# Altium schematic sheet Clock.SchDoc
size A3; SheetNumber: 8; SheetTotal: 13
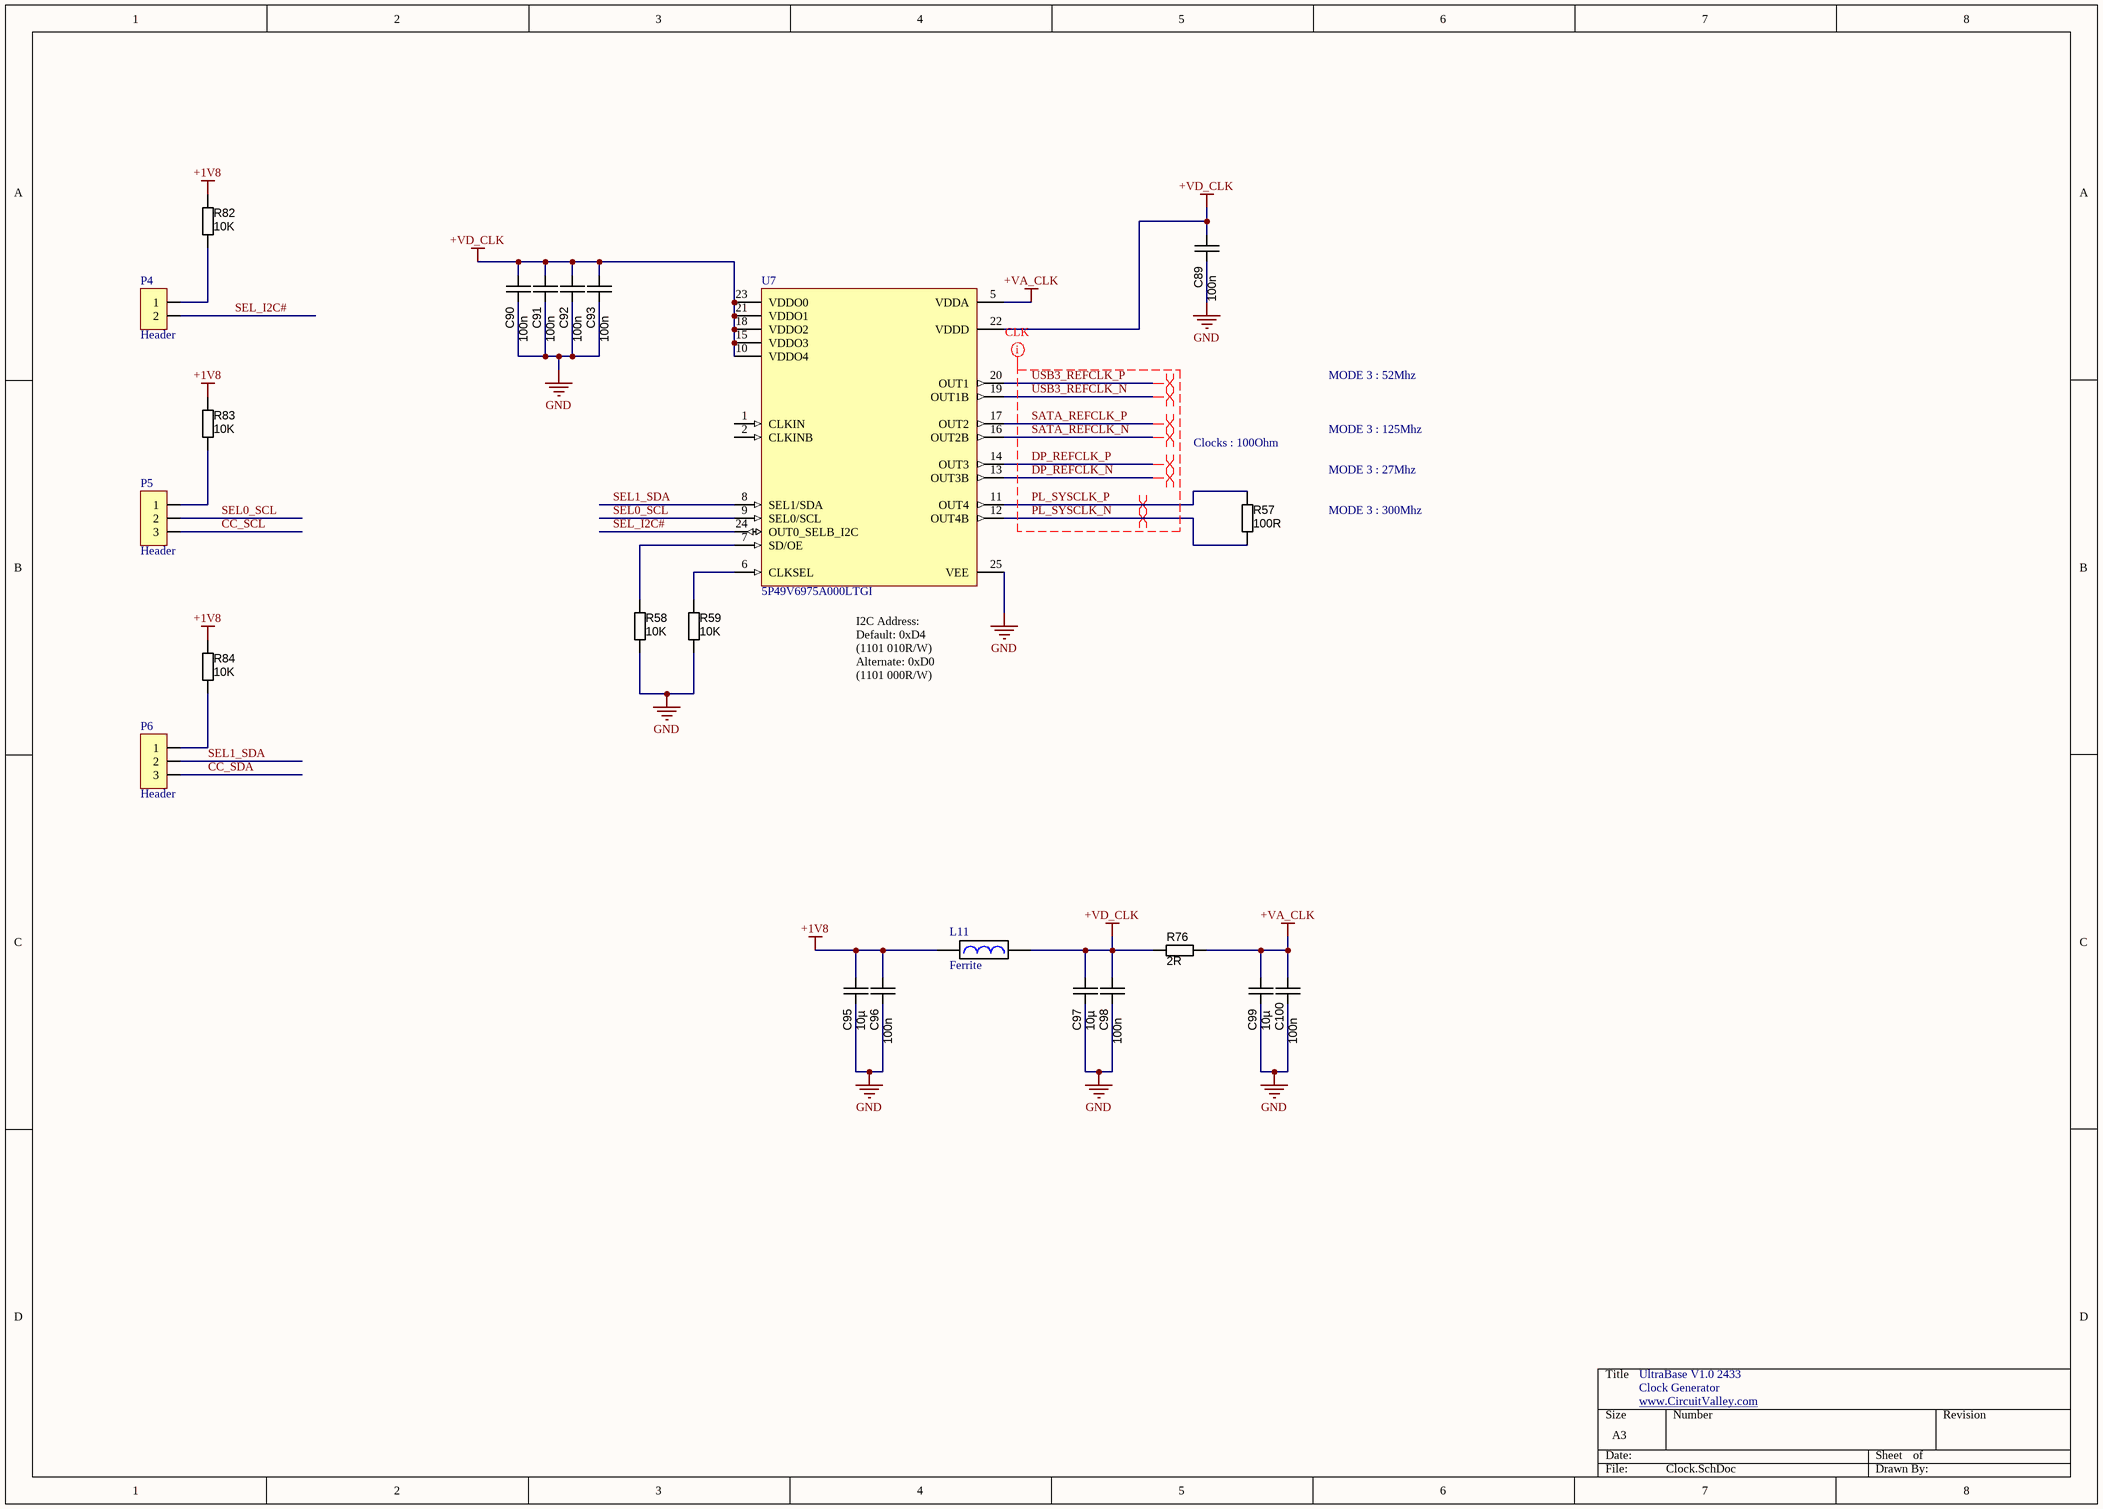
[diagram p0: Clock.SchDoc]

## Parts
C89  100n  [CAPC1608N]
C90  100n  [CAPC1608N]
C91  100n  [CAPC1608N]
C92  100n  [CAPC1608N]
C93  100n  [CAPC1608N]
C95  10µ  [CAPC3225N]
C96  100n  [CAPC1608N]
C97  10µ  [CAPC3225N]
C98  100n  [CAPC1608N]
C99  10µ  [CAPC3225N]
C100  100n  [CAPC1608N]
L11  Ferrite  [FBC2012N]
P4  Header  [Header2x]
P5  Header  [Header3x]
P6  Header  [Header3x]
R57  value 100R  [RESC1608N]  (hidden comment: RES_NL_0603)
R58  value 10K  [RESC1608N]  (hidden comment: RES_NL_0603)
R59  value 10K  [RESC1608N]  (hidden comment: RES_NL_0603)
R76  value 2R  [RESC1608N]  (hidden comment: RES_NL_0603)
R82  value 10K  [RESC1608N]  (hidden comment: RES_NL_0603)
R83  value 10K  [RESC1608N]  (hidden comment: RES_NL_0603)
R84  value 10K  [RESC1608N]  (hidden comment: RES_NL_0603)
U7  5P49V6975A000LTGI  [LGA24]

## Nets
+1V8: C95.1 C96.1 L11.1 R82.2 R83.2 R84.2
+VA_CLK: C99.1 C100.1 R76.2 U7.5(VDDA)
+VD_CLK: C89.1 C90.1 C91.1 C92.1 C93.1 C97.1 C98.1 L11.2 R76.1 U7.10(VDDO4) U7.15(VDDO3) U7.18(VDDO2) U7.21(VDDO1) U7.22(VDDD) U7.23(VDDO0)
GND: C89.2 C90.2 C91.2 C92.2 C93.2 C95.2 C96.2 C97.2 C98.2 C99.2 C100.2 R58.1 R59.1 U7.25(VEE)
CC_SCL: P5.3
CC_SDA: P6.3
DP_REFCLK_N: U7.13(OUT3B)
DP_REFCLK_P: U7.14(OUT3)
PL_SYSCLK_N: R57.2 U7.12(OUT4B)
PL_SYSCLK_P: R57.1 U7.11(OUT4)
SATA_REFCLK_N: U7.16(OUT2B)
SATA_REFCLK_P: U7.17(OUT2)
SEL0_SCL: P5.2 U7.9(SEL0/SCL)
SEL1_SDA: P6.2 U7.8(SEL1/SDA)
SEL_I2C#: P4.2 U7.24(OUT0_SELB_I2C)
USB3_REFCLK_N: U7.19(OUT1B)
USB3_REFCLK_P: U7.20(OUT1)
NetP4_1: P4.1 R82.1
NetP5_1: P5.1 R83.1
NetP6_1: P6.1 R84.1
NetR58_2: R58.2 U7.7(SD/OE)
NetR59_2: R59.2 U7.6(CLKSEL)

Not connected (* = marked no-connect by the designer): U7 1(CLKIN) 2(CLKINB)

## Layout directives
differential pair: DP_REFCLK_N, DP_REFCLK_P, PL_SYSCLK_N, PL_SYSCLK_P, SATA_REFCLK_N, SATA_REFCLK_P, USB3_REFCLK_N, USB3_REFCLK_P
net class CLK: DP_REFCLK_N, DP_REFCLK_P, PL_SYSCLK_N, PL_SYSCLK_P, SATA_REFCLK_N, SATA_REFCLK_P, USB3_REFCLK_N, USB3_REFCLK_P

## Notes on the sheet
- MODE 3 : 52Mhz
- Clocks : 100Ohm
- MODE 3 : 125Mhz
- MODE 3 : 300Mhz
- MODE 3 : 27Mhz
- (near U7) I2C Address:
  Default: 0xD4
  (1101 010R/W)
  Alternate: 0xD0
  (1101 000R/W)
- UltraBase V1.0 2433
- Clock Generator
- www.CircuitValley.com <http://www.CircuitValley.com>

## Library data of the parts
C89-C93 C96 C98 C100 = CAPC_120p_0603_C0G_50V: Capacitor SMD Cer 120pF 10% 50V C0G 0603; Manufacturer 1: Kemet; Manufacturer Part Number 1: C0603C121K5GACTU; Ratings: 50V; C0G; Tolerance: ±10%; Operating Temperature: -55°C ~ 125°C; Package / Case: 0603 (1608 Metric); Supplier 1: Mouser; Supplier Part Number 1: 80-C0603C121K5G; Value: 100n
C95 C97 C99 = CAPC_10u_1210_50V: Capacitor SMD Cer 10uF 20% 16V X5R 1210; Manufacturer 1: Taiyo Yuden; Manufacturer Part Number 1: UMK325BJ106MM-T; Ratings: 50V; X5R; Material: ceramic; Package / Case: 1210 (3225 Metric); Tolerance: ±20%; Size / Dimension: 0.126" L x 0.098" W (3.20mm x 2.50mm); Supplier 1: Digi-Key; Supplier Part Number 1: 587-2225-1-ND; Value: 10µ
L11 = Ferrite Bead
P4 = Header_2Pin: 2 Pin Header
P5 P6 = Header_3Pin: 3 Pin Header
R57-R59 R76 R82-R84 = RES_NL_0603: Resistor, SMD chip; Manufacturer 1: Royal Ohm; Ratings: 1/10 W; Tolerance: ±5%; Package / Case: 0603 (1608 metric)
U7 = 5P49V6975: Programmable Clock Generators